# EAGLE design ATXBreakout (EAGLE 6.5.0)
DRAWING_AUTHOR: G Goldberg & A Ladds
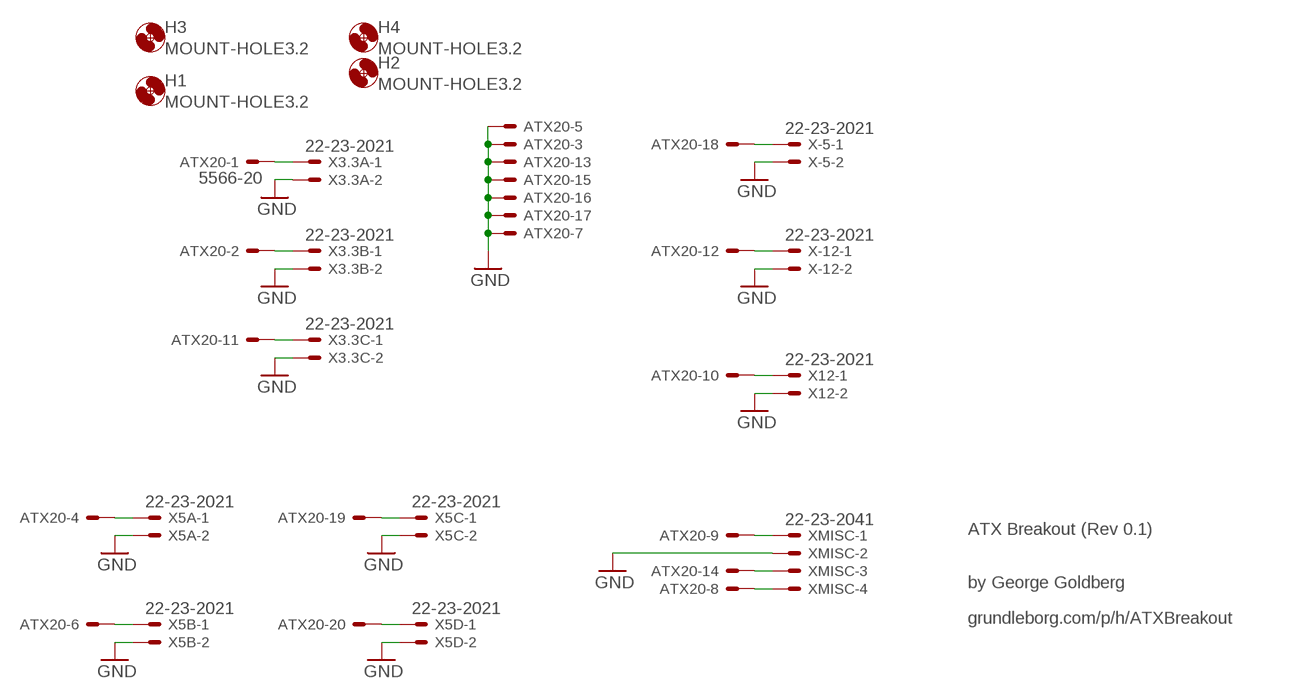
[diagram p0: schematic, sheet 1]

## Parts
ATX20  5566-20  [5566-20]
H1  MOUNT-HOLE3.2  [3,2]
H2  MOUNT-HOLE3.2  [3,2]
H3  MOUNT-HOLE3.2  [3,2]
H4  MOUNT-HOLE3.2  [3,2]
X3.3A  22-23-2021  [22-23-2021]
X3.3B  22-23-2021  [22-23-2021]
X3.3C  22-23-2021  [22-23-2021]
X5A  22-23-2021  [22-23-2021]
X5B  22-23-2021  [22-23-2021]
X5C  22-23-2021  [22-23-2021]
X5D  22-23-2021  [22-23-2021]
X12  22-23-2021  [22-23-2021]
X-5  22-23-2021  [22-23-2021]
X-12  22-23-2021  [22-23-2021]
XMISC  22-23-2041  [22-23-2041]

## Nets
GND: ATX20.3 ATX20.5 ATX20.7 ATX20.13 ATX20.15 ATX20.16 ATX20.17 X3.3A.2 X3.3B.2 X3.3C.2 X5A.2 X5B.2 X5C.2 X5D.2 X12.2 X-5.2 X-12.2 XMISC.2
N$1: ATX20.1 X3.3A.1
N$2: ATX20.2 X3.3B.1
N$3: ATX20.11 X3.3C.1
N$4: ATX20.4 X5A.1
N$5: ATX20.6 X5B.1
N$6: ATX20.19 X5C.1
N$7: ATX20.20 X5D.1
N$8: ATX20.18 X-5.1
N$9: ATX20.12 X-12.1
N$10: ATX20.9 XMISC.1
N$11: ATX20.14 XMISC.3
N$12: ATX20.8 XMISC.4
N$15: ATX20.10 X12.1

## Notes on the sheet
- ATX Breakout (Rev 0.1)
- by George Goldberg
- grundleborg.com/p/h/ATXBreakout

## Library data of the parts
ATX20 = con-molex:5566-20: Mini FIT connector 20 pol ATX PC-Motherboard Power connector Source: http://www.molex.com; OC_FARNELL: unknown; OC_NEWARK: unknown
H1-H4 = holes:MOUNT-HOLE: MOUNTING HOLE with drill center marker
X3.3A X3.3B X3.3C X5A X5B X5C X5D X12 X-5 X-12 = con-molex:22-23-2021: .100" (2.54mm) Center Header - 2 Pin; MF: MOLEX; MPN: 22-23-2021; OC_FARNELL: 1462926; OC_NEWARK: 25C3832
XMISC = con-molex:22-23-2041: .100" (2.54mm) Center Header - 4 Pin; MF: MOLEX; MPN: 22-23-2041; OC_FARNELL: 1462920; OC_NEWARK: 38C0355

## Net classes
0 default: width 1.27 mm
1 50mil: width 1.27 mm

## Board
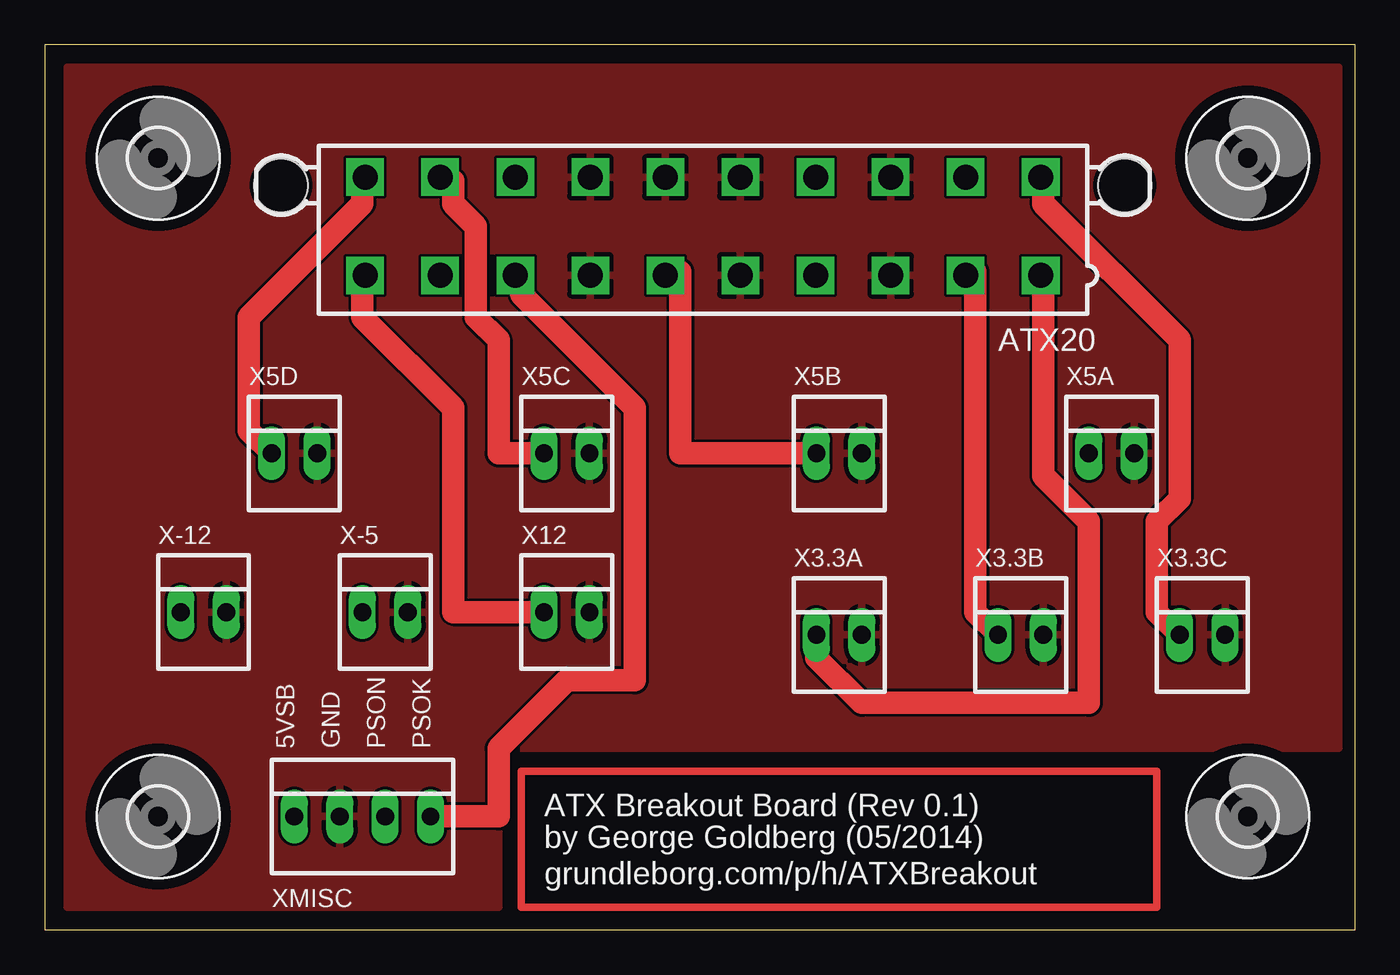
[diagram p1: board, top side]
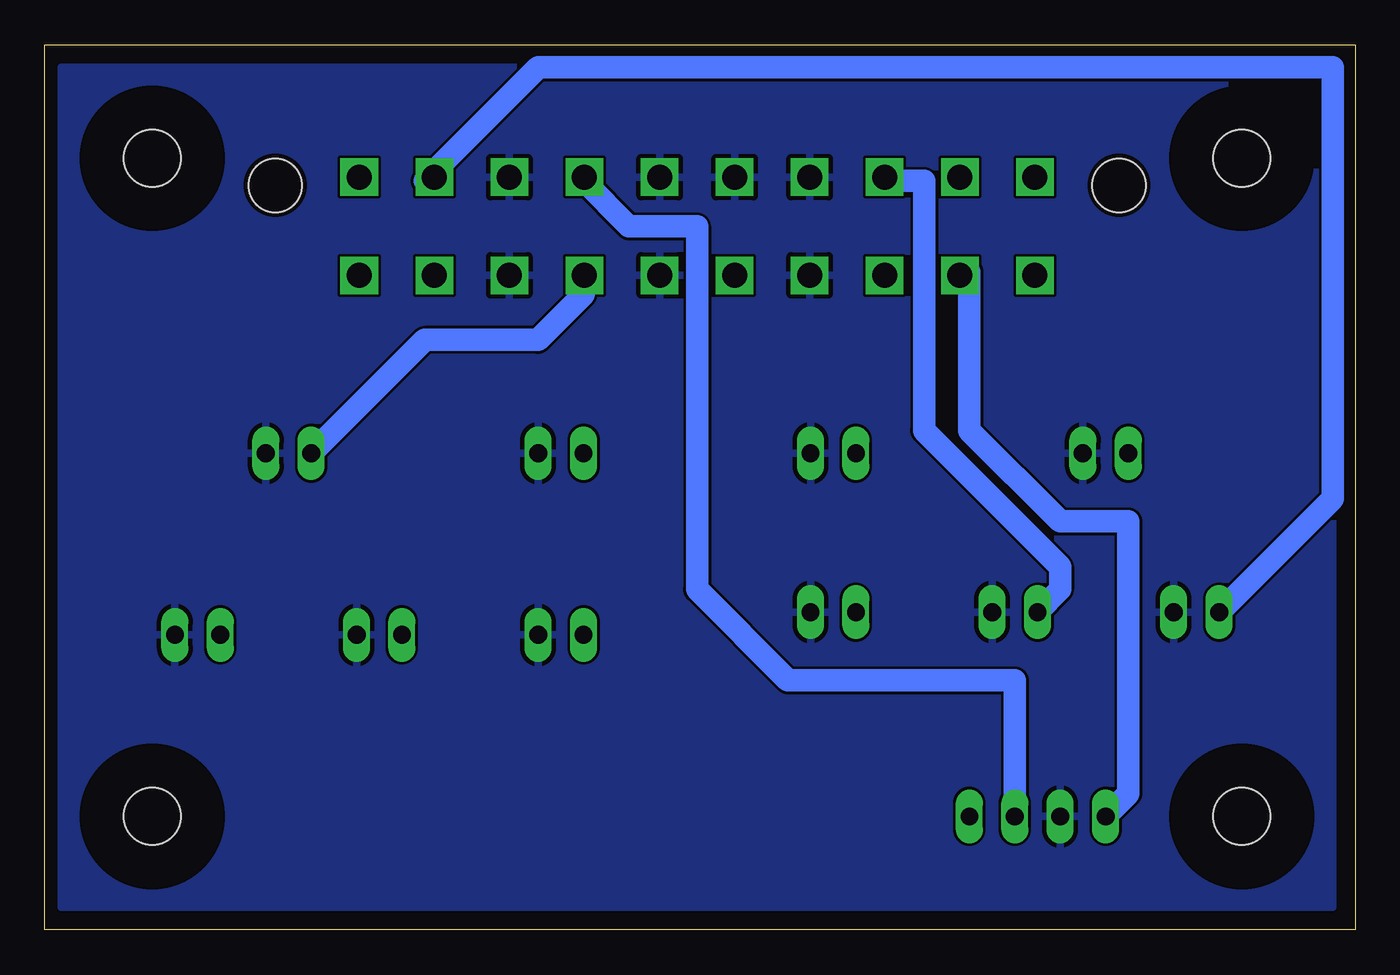
[diagram p2: board, bottom side, seen from below]

Size 73.33 x 49.52 mm. Coordinates in mm from the lower left corner, seen from the top.
Outline: 0,0 73.33,0 73.33,49.52 0,49.52 0,0
Copper layers (1*16): Top 0.035mm / dielectric 1.5mm / Bottom 0.035mm
Design rules "ITEADstudio_DRC": minimum track width 6mil, minimum drill 12mil, track to track 6mil, track to pad 6mil, pad to pad 6mil, via to via 6mil, smd to smd 0mil, copper to edge 10mil, drill to drill 10mil, minimum pad ring 10mil, minimum via ring 6mil, stop-mask expansion 2mil, vias tented up to drill 100mil, thermal gap 10mil

### Footprints (pad centres in the part's own frame; a part is rotated, then mirrored left to right if it is on the bottom)
5566-20 = drill 1.4 square: 1 18.9,-2.75; 2 14.7,-2.75; 3 10.5,-2.75; 4 6.3,-2.75; 5 2.1,-2.75; 6 -2.1,-2.75; 7 -6.3,-2.75; 8 -10.5,-2.75; 9 -14.7,-2.75; 10 -18.9,-2.75; 11 18.9,2.75; 12 14.7,2.75; 13 10.5,2.75; 14 6.3,2.75; 15 2.1,2.75; 16 -2.1,2.75; 17 -6.3,2.75; 18 -10.5,2.75; 19 -14.7,2.75; 20 -18.9,2.75 | hole 3: 23.6,2.29; -23.6,2.29
3,2 = hole 3.2: 0,0
22-23-2021 = drill 1 long: 1 -1.27,0; 2 1.27,0
22-23-2041 = drill 1 long: 1 -3.81,0; 2 -1.27,0; 3 1.27,0; 4 3.81,0

### Placement (x,y rotation side)
ATX20  36.83,39.37 0 top
H1  6.35,43.18 0 top
H2  67.31,43.18 0 top
H3  67.31,6.35 0 top
H4  6.35,6.35 0 top
X3.3A  44.45,16.51 0 top
X3.3B  54.61,16.51 0 top
X3.3C  64.77,16.51 0 top
X5A  59.69,26.67 0 top
X5B  44.45,26.67 0 top
X5C  29.21,26.67 0 top
X5D  13.97,26.67 0 top
X12  29.21,17.78 0 top
X-5  19.05,17.78 0 top
X-12  8.89,17.78 0 top
XMISC  17.78,6.35 0 top

### Tracks (layer width: path | path; a pad name or v marks a point on that pad's centre or on a via)
GND
  pour Bottom: 1.27,48.26 72.39,48.26 72.39,1.27 1.27,1.27
  pour Top: 1.27,48.26 1.27,1.27 25.4,1.27 25.4,10.16 72.39,10.16 72.39,48.26
N$1
  Top 1.27: X3.3A.1 43.18,15.24 45.72,12.7 58.42,12.7 58.42,22.86 55.88,25.4 55.88,36.83 ATX20.1
N$2
  Top 1.27: X3.3B.1 52.07,17.78 52.07,36.83 ATX20.2
N$3
  Top 1.27: X3.3C.1 62.23,17.78 62.23,22.86 63.5,24.13 63.5,33.02 55.88,40.64 55.88,41.91 ATX20.11
N$4
  Bottom 1.27: X5A.1 52.07,33.02 45.72,33.02 43.18,35.56 43.18,36.83 ATX20.4
N$5
  Top 1.27: X5B.1 35.56,26.67 35.56,36.83 ATX20.6
N$6
  Top 1.27: X5C.1 25.4,26.67 25.4,33.02 24.13,34.29 24.13,39.37 22.86,40.64 22.86,41.91 ATX20.19
N$7
  Top 1.27: X5D.1 11.43,27.94 11.43,34.29 17.78,40.64 17.78,41.91 ATX20.20
N$8
  Bottom 1.27: X-5.1 16.51,19.05 16.51,20.32 24.13,27.94 24.13,41.91 25.4,41.91 ATX20.18
N$9
  Bottom 1.27: X-12.1 1.27,24.13 1.27,48.26 45.72,48.26 52.07,41.91 ATX20.12
N$10
  Bottom 1.27: XMISC.1 12.7,7.62 12.7,22.86 16.51,22.86 21.59,27.94 21.59,36.83 ATX20.9
N$11
  Bottom 1.27: XMISC.3 19.05,13.97 31.75,13.97 36.83,19.05 36.83,39.37 40.64,39.37 43.18,41.91 ATX20.14
N$12
  Top 1.27: XMISC.4 25.4,6.35 25.4,10.16 29.21,13.97 33.02,13.97 33.02,29.21 26.67,35.56 26.67,36.83 ATX20.8
N$13
  Top 0.406: 26.67,1.27 26.67,8.89 62.23,8.89 62.23,1.27 26.67,1.27
N$15
  Top 1.27: X12.1 22.86,17.78 22.86,29.21 17.78,34.29 17.78,36.83 ATX20.10

### Text on the board
tNames: 5VSB | GND | PSON | PSOK | ATX Breakout Board (Rev 0.1) | by George Goldberg (05/2014) | grundleborg.com/p/h/ATXBreakout